# Altium project Dashcam.PrjPcb (part 7 of 8)

## Sheet CAMERA.SchDoc
size A2; SheetNumber: 20; SheetTotal: 22
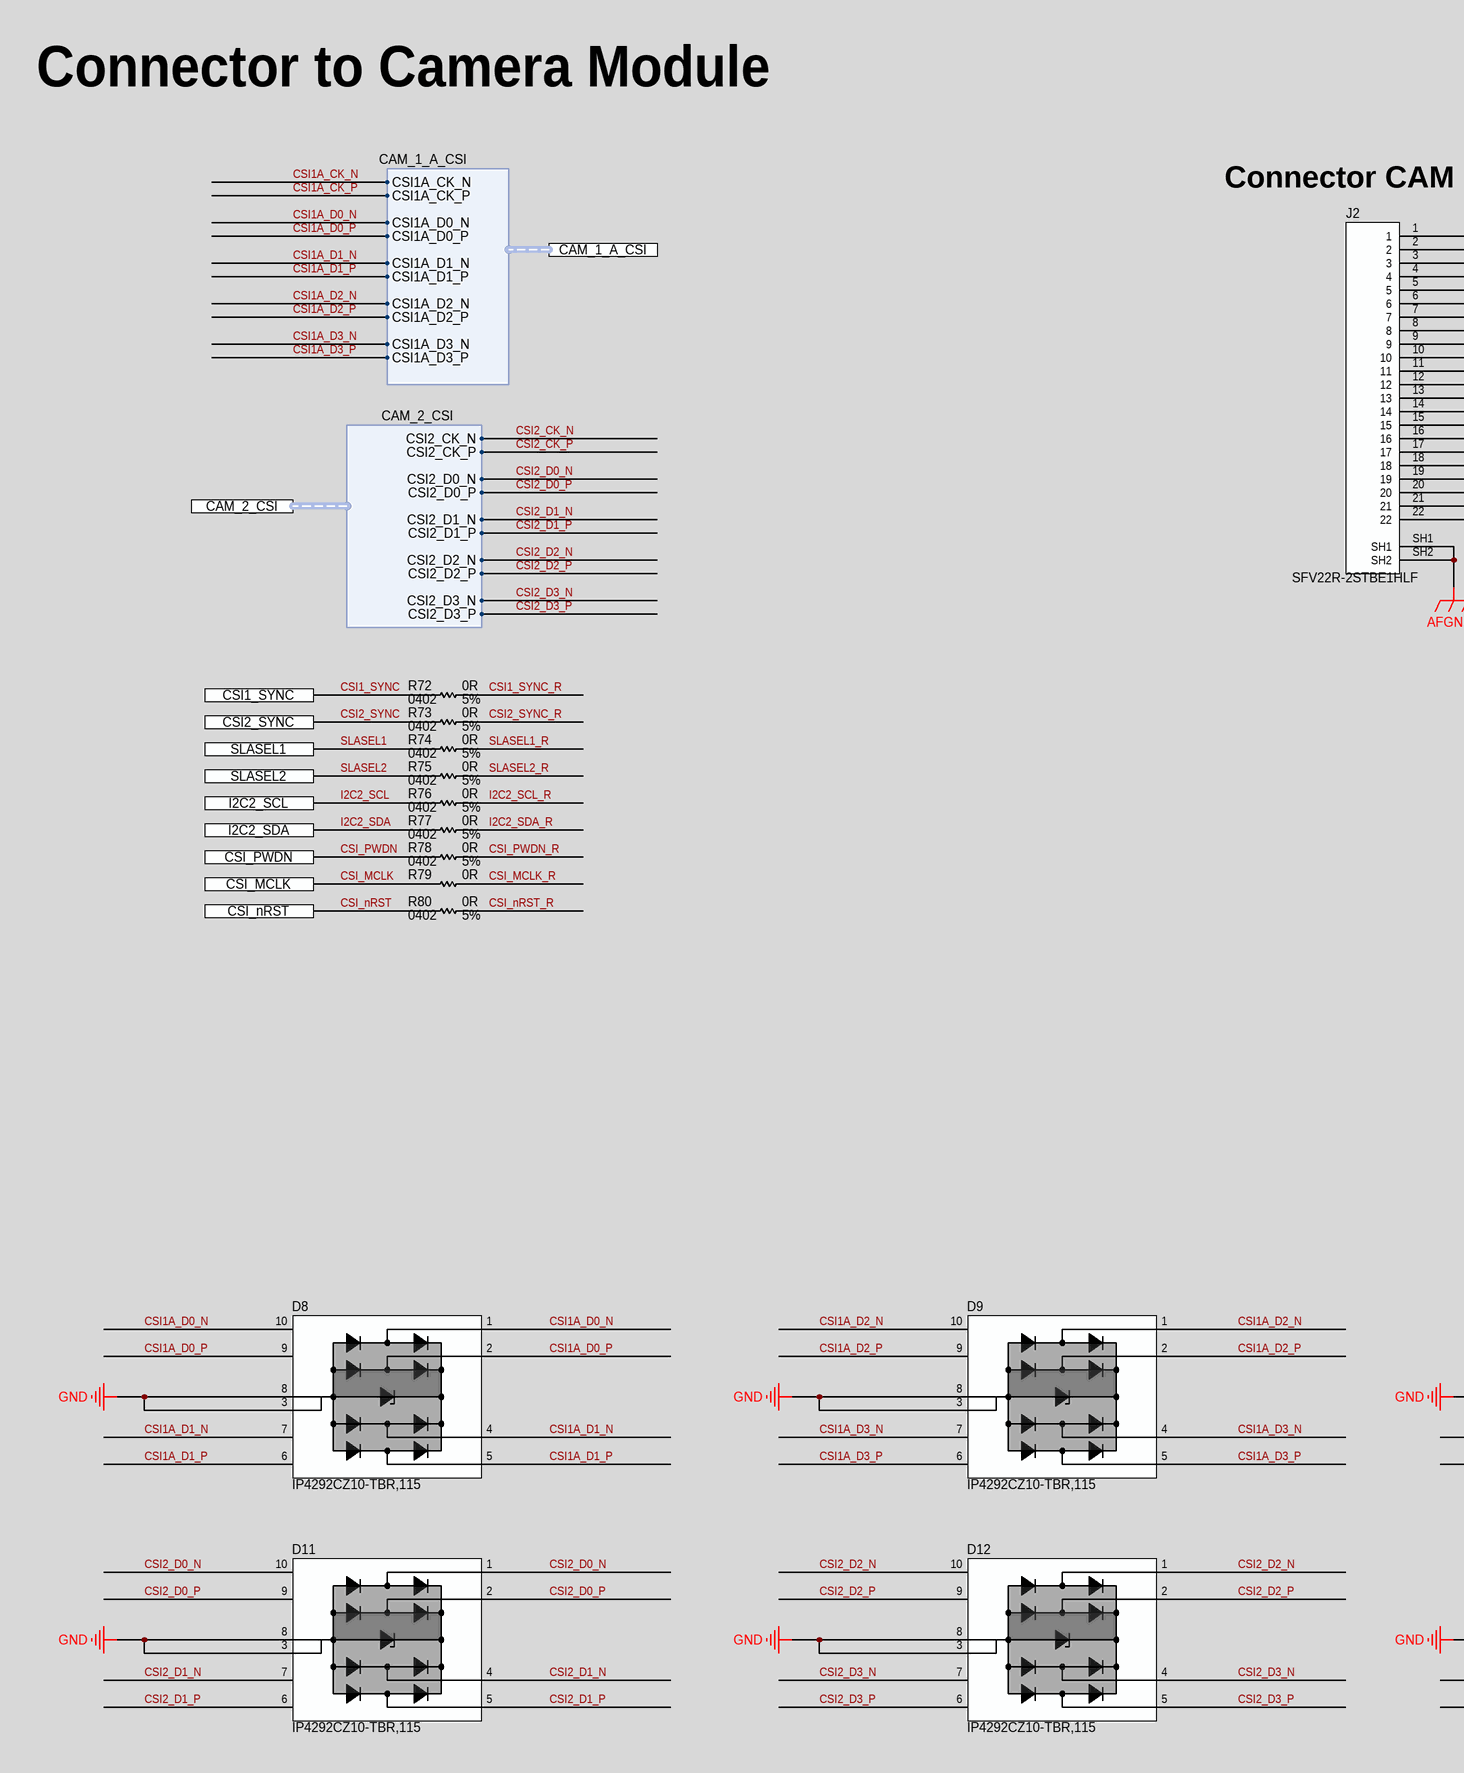
[diagram p17: CAMERA.SchDoc, left]
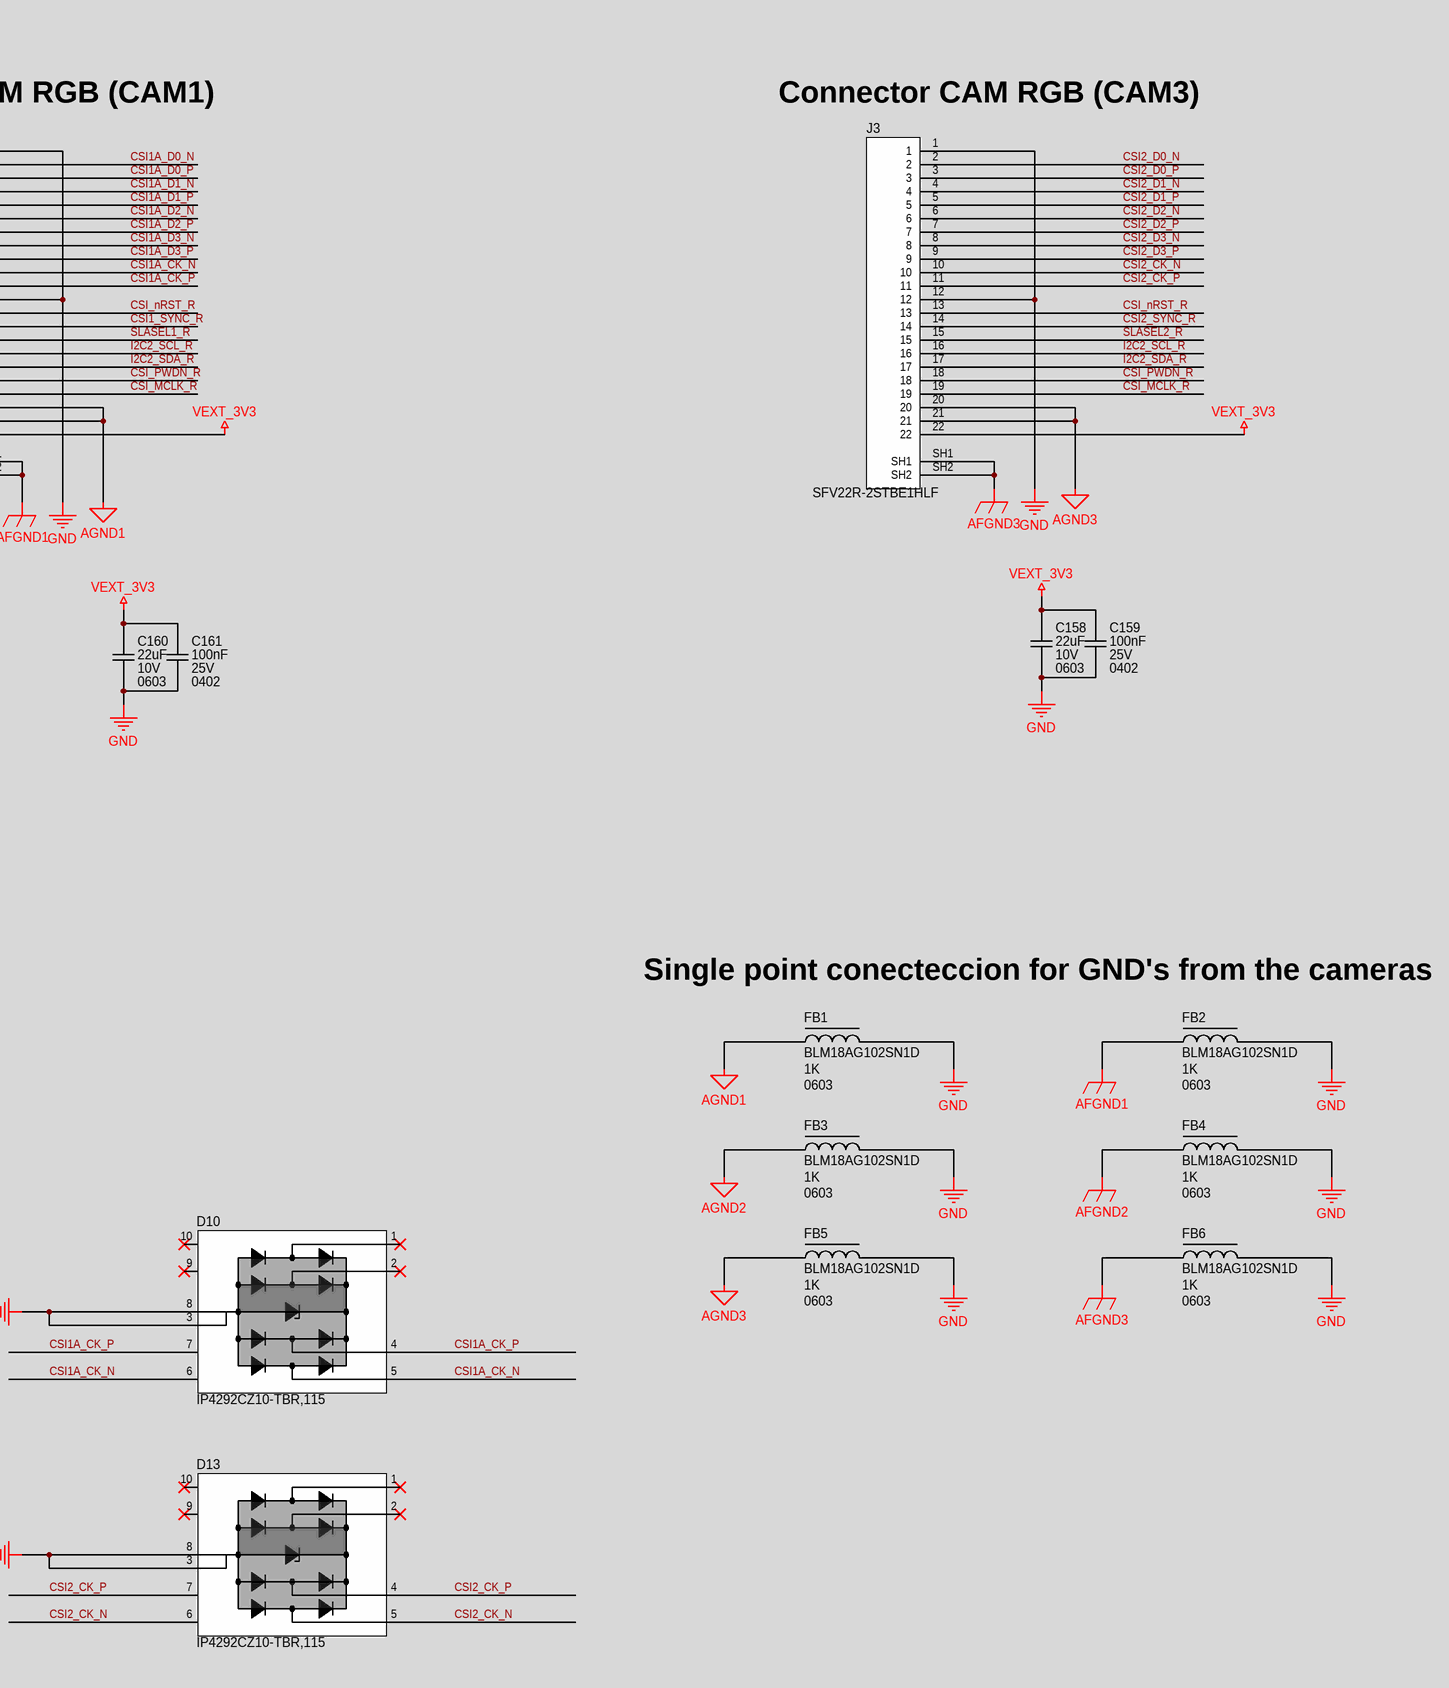
[diagram p18: CAMERA.SchDoc, right]

### Parts
C158  Capacitance: 22uF  Voltage Rating: 10V  Case Code (Imperial): 0603  [CAP_0603_CAPC1608X08N]  (hidden comment: C1608X5R1A226M080AC)
C159  Capacitance: 100nF  Voltage Rating: 25V  Case/Package: 0402  [CAP_0402_CAPC1005X05N]  (hidden comment: CC0402KRX5R8BB104)
C160  Capacitance: 22uF  Voltage Rating: 10V  Case Code (Imperial): 0603  [CAP_0603_CAPC1608X08N]  (hidden comment: C1608X5R1A226M080AC)
C161  Capacitance: 100nF  Voltage Rating: 25V  Case/Package: 0402  [CAP_0402_CAPC1005X05N]  (hidden comment: CC0402KRX5R8BB104)
D8  IP4292CZ10-TBR,115  [DIO_TVS_SON50P100X250X50-10N]
D9  IP4292CZ10-TBR,115  [DIO_TVS_SON50P100X250X50-10N]
D10  IP4292CZ10-TBR,115  [DIO_TVS_SON50P100X250X50-10N]
D11  IP4292CZ10-TBR,115  [DIO_TVS_SON50P100X250X50-10N]
D12  IP4292CZ10-TBR,115  [DIO_TVS_SON50P100X250X50-10N]
D13  IP4292CZ10-TBR,115  [DIO_TVS_SON50P100X250X50-10N]
FB1  BLM18AG102SN1D  Impedance: 1K  Case/Package: 0603  [IND_0603_INDC1608X08N]
FB2  BLM18AG102SN1D  Impedance: 1K  Case/Package: 0603  [IND_0603_INDC1608X08N]
FB3  BLM18AG102SN1D  Impedance: 1K  Case/Package: 0603  [IND_0603_INDC1608X08N]
FB4  BLM18AG102SN1D  Impedance: 1K  Case/Package: 0603  [IND_0603_INDC1608X08N]
FB5  BLM18AG102SN1D  Impedance: 1K  Case/Package: 0603  [IND_0603_INDC1608X08N]
FB6  BLM18AG102SN1D  Impedance: 1K  Case/Package: 0603  [IND_0603_INDC1608X08N]
J2  SFV22R-2STBE1HLF  [CONN_FPC_AMPHENOL_SFV22R-2STBE1HLF]
J3  SFV22R-2STBE1HLF  [CONN_FPC_AMPHENOL_SFV22R-2STBE1HLF]
R72  Case Code (Imperial): 0402  Tolerance: 5%  Resistance: 0R  [RES_0402_RESC1005X04N]  (hidden comment: ERJ-2GE0R00X)
R73  Case Code (Imperial): 0402  Tolerance: 5%  Resistance: 0R  [RES_0402_RESC1005X04N]  (hidden comment: ERJ-2GE0R00X)
R74  Case Code (Imperial): 0402  Tolerance: 5%  Resistance: 0R  [RES_0402_RESC1005X04N]  (hidden comment: ERJ-2GE0R00X)
R75  Case Code (Imperial): 0402  Tolerance: 5%  Resistance: 0R  [RES_0402_RESC1005X04N]  (hidden comment: ERJ-2GE0R00X)
R76  Case Code (Imperial): 0402  Tolerance: 5%  Resistance: 0R  [RES_0402_RESC1005X04N]  (hidden comment: ERJ-2GE0R00X)
R77  Case Code (Imperial): 0402  Tolerance: 5%  Resistance: 0R  [RES_0402_RESC1005X04N]  (hidden comment: ERJ-2GE0R00X)
R78  Case Code (Imperial): 0402  Tolerance: 5%  Resistance: 0R  [RES_0402_RESC1005X04N]  (hidden comment: ERJ-2GE0R00X)
R79  Resistance: 0R  [RES_0402_RESC1005X04N]  (hidden comment: ERJ-2GE0R00X)
R80  Case Code (Imperial): 0402  Tolerance: 5%  Resistance: 0R  [RES_0402_RESC1005X04N]  (hidden comment: ERJ-2GE0R00X)

### Ports
CAM_1_A_CSI (harness CAM_1_A_CSI), CAM_2_CSI (harness CAM_2_CSI), CSI1_SYNC, CSI2_SYNC, CSI_MCLK, CSI_nRST, CSI_PWDN, I2C2_SCL, I2C2_SDA, SLASEL1, SLASEL2

### Harnesses
CAM_2_CSI: CSI2_CK_N, CSI2_CK_P, CSI2_D0_N, CSI2_D0_P, CSI2_D1_N, CSI2_D1_P, CSI2_D2_N, CSI2_D2_P, CSI2_D3_N, CSI2_D3_P
CAM_1_A_CSI: CSI1A_CK_N, CSI1A_CK_P, CSI1A_D0_N, CSI1A_D0_P, CSI1A_D1_N, CSI1A_D1_P, CSI1A_D2_N, CSI1A_D2_P, CSI1A_D3_N, CSI1A_D3_P

### Nets
AFGND1: FB2.1 J2.SH1 J2.SH2
AFGND2: FB4.1
AFGND3: FB6.1 J3.SH1 J3.SH2
AGND1: FB1.1 J2.20 J2.21
AGND2: FB3.1
AGND3: FB5.1 J3.20 J3.21
GND: C158.1 C159.1 C160.1 C161.1 D8.3(GND1) D8.8(GND2) D9.3(GND1) D9.8(GND2) D10.3(GND1) D10.8(GND2) D11.3(GND1) D11.8(GND2) D12.3(GND1) D12.8(GND2) D13.3(GND1) D13.8(GND2) FB1.2 FB2.2 FB3.2 FB4.2 FB5.2 FB6.2 J2.1 J2.12 J3.1 J3.12
VEXT_3V3: C158.2 C159.2 C160.2 C161.2 J2.22 J3.22
CSI1_SYNC: R72.1 ; port CSI1_SYNC
CSI1_SYNC_R: J2.14 R72.2
CSI1A_CK_N: D10.5(CH4) D10.6(NC1) J2.10 ; port CAM_1_A_CSI.CSI1A_CK_N
CSI1A_CK_P: D10.4(CH3) D10.7(NC2) J2.11 ; port CAM_1_A_CSI.CSI1A_CK_P
CSI1A_D0_N: D8.1(CH1) D8.10(NC4) J2.2 ; port CAM_1_A_CSI.CSI1A_D0_N
CSI1A_D0_P: D8.2(CH2) D8.9(NC3) J2.3 ; port CAM_1_A_CSI.CSI1A_D0_P
CSI1A_D1_N: D8.4(CH3) D8.7(NC2) J2.4 ; port CAM_1_A_CSI.CSI1A_D1_N
CSI1A_D1_P: D8.5(CH4) D8.6(NC1) J2.5 ; port CAM_1_A_CSI.CSI1A_D1_P
CSI1A_D2_N: D9.1(CH1) D9.10(NC4) J2.6 ; port CAM_1_A_CSI.CSI1A_D2_N
CSI1A_D2_P: D9.2(CH2) D9.9(NC3) J2.7 ; port CAM_1_A_CSI.CSI1A_D2_P
CSI1A_D3_N: D9.4(CH3) D9.7(NC2) J2.8 ; port CAM_1_A_CSI.CSI1A_D3_N
CSI1A_D3_P: D9.5(CH4) D9.6(NC1) J2.9 ; port CAM_1_A_CSI.CSI1A_D3_P
CSI2_CK_N: D13.5(CH4) D13.6(NC1) J3.10 ; port CAM_2_CSI.CSI2_CK_N
CSI2_CK_P: D13.4(CH3) D13.7(NC2) J3.11 ; port CAM_2_CSI.CSI2_CK_P
CSI2_D0_N: D11.1(CH1) D11.10(NC4) J3.2 ; port CAM_2_CSI.CSI2_D0_N
CSI2_D0_P: D11.2(CH2) D11.9(NC3) J3.3 ; port CAM_2_CSI.CSI2_D0_P
CSI2_D1_N: D11.4(CH3) D11.7(NC2) J3.4 ; port CAM_2_CSI.CSI2_D1_N
CSI2_D1_P: D11.5(CH4) D11.6(NC1) J3.5 ; port CAM_2_CSI.CSI2_D1_P
CSI2_D2_N: D12.1(CH1) D12.10(NC4) J3.6 ; port CAM_2_CSI.CSI2_D2_N
CSI2_D2_P: D12.2(CH2) D12.9(NC3) J3.7 ; port CAM_2_CSI.CSI2_D2_P
CSI2_D3_N: D12.4(CH3) D12.7(NC2) J3.8 ; port CAM_2_CSI.CSI2_D3_N
CSI2_D3_P: D12.5(CH4) D12.6(NC1) J3.9 ; port CAM_2_CSI.CSI2_D3_P
CSI2_SYNC: R73.1 ; port CSI2_SYNC
CSI2_SYNC_R: J3.14 R73.2
CSI_MCLK: R79.1 ; port CSI_MCLK
CSI_MCLK_R: J2.19 J3.19 R79.2
CSI_nRST: R80.1 ; port CSI_nRST
CSI_nRST_R: J2.13 J3.13 R80.2
CSI_PWDN: R78.1 ; port CSI_PWDN
CSI_PWDN_R: J2.18 J3.18 R78.2
I2C2_SCL: R76.1 ; port I2C2_SCL
I2C2_SCL_R: J2.16 J3.16 R76.2
I2C2_SDA: R77.1 ; port I2C2_SDA
I2C2_SDA_R: J2.17 J3.17 R77.2
SLASEL1: R74.1 ; port SLASEL1
SLASEL1_R: J2.15 R74.2
SLASEL2: R75.1 ; port SLASEL2
SLASEL2_R: J3.15 R75.2

Not connected (* = marked no-connect by the designer): D10 1(CH1)* 2(CH2)* 9(NC3)* 10(NC4)*; D13 1(CH1)* 2(CH2)* 9(NC3)* 10(NC4)*

### Notes on the sheet
- Connector to Camera Module
- (near J2) Connector CAM RGB (CAM1)
- (near J3) Connector CAM RGB (CAM3)
- Single point conecteccion for GND's from the cameras
- PCB Des :
- Approv By :
- Project Title :
- Sheet Title :
- Date :
- Page :
- PCB Version :
- PCB Revision :
- Size :
- A2

### Library data of the parts
C158 C160 = CAP_22UF_10V_X5R_0603: Multilayer Ceramic Capacitor, 22 uF, 10 V, ± 20%, X5R, 0603 [1608 Metric]; Manufacturer: TDK; Supplier 1: Digi-Key; Manufacturer Part Number: C1608X5R1A226M080AC; RoHS: Yes; Category: Ceramic Capacitors; Stock 1: 1971709; Pricing 1: 1=0.32, 10=0.208, 50=0.1534, 100=0.1248, 500=0.09856, 1000=0.08323 (USD); Mount: Surface Mount; Case/Package: 0603; Case Code (Metric): 1608; Dielectric Material: Ceramic; Weight: 7.1E-05oz; Min Operating Temperature: -55°C; Max Operating Temperature: 85°C; Tolerance: 20%; Packaging: Tape and Reel; Voltage Rating (DC): 10V; Termination: SMD/SMT; Series: C; Package Quantity: 4000; Dielectric: X5R; Length: 1.6mm; Width: 0.8mm; Height: 0.8mm; Reach SVHC Compliant: No; Lead Free: Lead Free; RoHS Compliant: Yes; ComponentLink1URL: https://datasheet.ciiva.com/6274/tdkmlcccaprange-6274860.pdf?src-supplier=Digi-Key; ComponentLink1Description: https://datasheet.ciiva.com/6274/tdkmlcccaprange-6274860.pdf?src-supplier=Digi-Key; ComponentLink2URL: https://datasheet.ciiva.com/6274/tdkmlcccaprange-6274859.pdf?src-supplier=Digi-Key; ComponentLink2Description: https://datasheet.ciiva.com/6274/tdkmlcccaprange-6274859.pdf?src-supplier=Digi-Key; ComponentLink3URL: https://datasheet.ciiva.com/6274/tdkmlcccaprange-6274861.pdf?src-supplier=Digi-Key; ComponentLink3Description: https://datasheet.ciiva.com/6274/tdkmlcccaprange-6274861.pdf?src-supplier=Digi-Key; ComponentLink4URL: https://datasheet.ciiva.com/24216/mlcc-commercial-general-en-24216575.pdf?src-supplier=Mouser; ComponentLink4Description: https://datasheet.ciiva.com/24216/mlcc-commercial-general-en-24216575.pdf?src-supplier=Mouser; Supplier Part Number 1: 445-9077-1-ND
C159 C161 = CAP_100NF_25V_X7R_0402: Multilayer Ceramic Capacitor, 0.1 uF, 25 V, ± 10%, X7R, 0402 [1005 Metric]; Manufacturer: Yageo; Material: 4241ConductorMaterial; Dielectric: X5R; Temperature Coefficient: 30ppm/°C; Supplier 1: Digikey; Manufacturer Part Number: CC0402KRX5R8BB104; RoHS: Yes; Category: Ceramic Capacitors; Stock 1: 3706055; Pricing 1: 1=0.1, 10=0.037, 50=0.021, 100=0.0162, 500=0.01224, 1000=0.00961, 2500=0.00874, 5000=0.00804 (USD); Mount: Surface Mount; Case Code (Metric): 1005; Case Code (Imperial): 0402; Min Operating Temperature: -55°C; Max Operating Temperature: 85°C; Tolerance: 10%; Packaging: Tape and Reel; Voltage Rating (DC): 25V; Series: CC; RoHS Compliant: Yes; Lead Free: 5697LeadFree; Halogen Free: 5694HalogenFree; ComponentLink1URL: http://www.mouser.com/ds/2/447/UPY-GPHC_X5R_4V-to-50V_25-1131599.pdf?src-supplier=Mouser; ComponentLink1Description: http://www.mouser.com/ds/2/447/UPY-GPHC_X5R_4V-to-50V_25-1131599.pdf?src-supplier=Mouser; ComponentLink2URL: https://datasheet.octopart.com/CC0402KRX5R8BB104-Yageo-datasheet-137700082.pdf?src-supplier=Future+Electronics; ComponentLink2Description: https://datasheet.octopart.com/CC0402KRX5R8BB104-Yageo-datasheet-137700082.pdf?src-supplier=Future+Electronics; ComponentLink3URL: http://www.yageo.com/documents/recent/UPY-GPHC_X5R_4V-to-50V_25.pdf?src-supplier=Digikey; ComponentLink3Description: http://www.yageo.com/documents/recent/UPY-GPHC_X5R_4V-to-50V_25.pdf?src-supplier=Digikey; ComponentLink4URL: https://datasheet.octopart.com/CC0402KRX5R8BB104-Yageo-datasheet-140260304.pdf?src-supplier=Newark; ComponentLink4Description: https://datasheet.octopart.com/CC0402KRX5R8BB104-Yageo-datasheet-140260304.pdf?src-supplier=Newark; ComponentLink5URL: https://datasheet.octopart.com/CC0402KRX5R8BB104-Yageo-datasheet-170350636.pdf?src-supplier=Future+Electronics; ComponentLink5Description: https://datasheet.octopart.com/CC0402KRX5R8BB104-Yageo-datasheet-170350636.pdf?src-supplier=Future+Electronics; ComponentLink6URL: http://www.yageo.com/documents/recent/UPY-GPHC_X5R_4V-to-50V-16.pdf?src-supplier=Future+Electronics; ComponentLink6Description: http://www.yageo.com/documents/recent/UPY-GPHC_X5R_4V-to-50V-16.pdf?src-supplier=Future+Electronics; Supplier Part Number 1: 311-1697-6-ND
D8-D13 = DIO_TVS_4CH_4V_IP4292CZ10-TBR,115: IP4292CZ10 Series 4 Channel 4 V 0.55 pF ESD Protected TVS Diode - DFN2510A-10; Manufacturer: Nexperia; Supplier 1: Digikey; Manufacturer Part Number: IP4292CZ10-TBR,115; RoHS: Yes; Category: ESD and Circuit Protection ICs; Stock 1: 24808; Pricing 1: 1=0.51, 10=0.398, 100=0.2386, 500=0.22096, 1000=0.15025, 2000=0.13833 (USD); RoHS Compliant: Yes; ComponentLink1URL: https://assets.nexperia.com/documents/data-sheet/IP4292CZ10-TBR.pdf?src-supplier=Digikey; ComponentLink1Description: https://assets.nexperia.com/documents/data-sheet/IP4292CZ10-TBR.pdf?src-supplier=Digikey; Supplier Part Number 1: 1727-1219-1-ND
FB1-FB6 = IND_FERRITA_1K_450mA_BLM18AG102SN1D: Ferrite Beads Multi-Layer 1KOhm 25% 100MHz 450mA 500mOhm DCR 0603 T/R; Manufacturer: Murata; Material: Steel,Ferrite; Max DC Current: 400mA; DC Resistance (DCR): 500mR; Number of Lines: 1; Shielding: Unshielded; DC Resistance-Max: 700mR; Supplier 1: Digikey; Manufacturer Part Number: BLM18AG102SN1D; RoHS: Yes; Category: Ferrite Beads and Chips; Stock 1: 632067; Pricing 1: 1=0.1, 10=0.074, 25=0.0676, 50=0.0608, 100=0.0445, 250=0.0324, 500=0.02968, 1000=0.02564 (USD); Number of Pins: 2; Core Material: Ferrite; Case Code (Metric): 1608; Case Code (Imperial): 0603; Min Operating Temperature: -55°C; Max Operating Temperature: 125°C; Tolerance: 25%; Package Quantity: 1; Resistance: 500mR; Packaging: Tape and Reel; Current Rating: 400mA; Max Current Rating: 400mA; Termination: SMD/SMT; Test Frequency: 100MHz; DC Current: 400mA; Frequency: 100MHz; Number of Circuits: 1; Series: BLM18A; RMS Current (Irms): 450mA; Series Resistance: 500mR; Length: 1.6mm; Width: 0.8mm; Height: 0.8mm; Depth: 0.8mm; Radiation Hardening: No; Reach SVHC Compliant: No; Military Standard: Not; Lead Free: Lead Free; RoHS Compliant: Yes; ComponentLink1URL: https://datasheet.ciiva.com/1012/l0110s0100blm18a-1012016.pdf?src-supplier=Digikey; ComponentLink1Description: https://datasheet.ciiva.com/1012/l0110s0100blm18a-1012016.pdf?src-supplier=Digikey; ComponentLink2URL: https://datasheet.ciiva.com/5709/1756147-5709056.pdf?src-supplier=Farnell; ComponentLink2Description: https://datasheet.ciiva.com/5709/1756147-5709056.pdf?src-supplier=Farnell; ComponentLink3URL: https://datasheet.ciiva.com/11795/0900766b80032ea2-11795437.pdf?src-supplier=Rs; ComponentLink3Description: https://datasheet.ciiva.com/11795/0900766b80032ea2-11795437.pdf?src-supplier=Rs; ComponentLink4URL: https://datasheet.ciiva.com/29347/442253-da-01-en-chip-drossel-0603-1000r-400ma-1-6x0-8mm-29347887.pdf?src-supplier=Conrad; ComponentLink4Description: https://datasheet.ciiva.com/29347/442253-da-01-en-chip-drossel-0603-1000r-400ma-1-6x0-8mm-29347887.pdf?src-supplier=Conrad; ComponentLink5URL: https://datasheet.ciiva.com/41449/001172220-da-01-en-drossel-0603-1000r-1-6x0-8mm-4000st-41449508.pdf?src-supplier=Conrad; ComponentLink5Description: https://datasheet.ciiva.com/41449/001172220-da-01-en-drossel-0603-1000r-1-6x0-8mm-4000st-41449508.pdf?src-supplier=Conrad; ComponentLink6URL: https://datasheet.ciiva.com/1012/l0110s0100blm18a-1012014.pdf?src-supplier=Digikey; ComponentLink6Description: https://datasheet.ciiva.com/1012/l0110s0100blm18a-1012014.pdf?src-supplier=Digikey; ComponentLink7URL: https://datasheet.ciiva.com/1012/l0110s0100blm18a-1012015.pdf?src-supplier=Digikey; ComponentLink7Description: https://datasheet.ciiva.com/1012/l0110s0100blm18a-1012015.pdf?src-supplier=Digikey; ComponentLink8URL: https://datasheet.ciiva.com/16199/l0110s0100blm18a-16199225.pdf?src-supplier=Future+Electronics; ComponentLink8Description: https://datasheet.ciiva.com/16199/l0110s0100blm18a-16199225.pdf?src-supplier=Future+Electronics; ComponentLink9URL: https://datasheet.ciiva.com/8510/l0110s0100blm18a-8510154.pdf?src-supplier=Avnet; ComponentLink9Description: https://datasheet.ciiva.com/8510/l0110s0100blm18a-8510154.pdf?src-supplier=Avnet; ComponentLink10URL: https://datasheet.ciiva.com/1466/1756147-1466919.pdf?src-supplier=Element14; ComponentLink10Description: https://datasheet.ciiva.com/1466/1756147-1466919.pdf?src-supplier=Element14; ComponentLink11URL: https://datasheet.ciiva.com/1466/1756147-1466920.pdf?src-supplier=Element14; ComponentLink11Description: https://datasheet.ciiva.com/1466/1756147-1466920.pdf?src-supplier=Element14; Supplier Part Number 1: 490-1015-1-ND
J2 J3 = CONN_FPC_22P_0.5mm_SFV22R-2STBE1HLF: Conn FFC/FPC Connector SKT 22 POS 0.5mm Solder RA SMD Embossed T/R; Manufacturer: Amphenol ICC / FCI; Actuator Material: Glass,Polyphenylene; Voltage Rating: 50V; Current Rating: 500mA; Number of Positions: 22; Contact Location: Top; Insulation Resistance: 100MR; Wire/Cable Type: Straight; Supplier 1: Digikey; Manufacturer Part Number: SFV22R-2STBE1HLF; RoHS: Yes; Category: FFC / FPC; Stock 1: 4153; Pricing 1: 1=0.74, 10=0.627, 25=0.6016, 50=0.5888, 100=0.5633, 250=0.51208, 500=0.46086, 1000=0.40966 (USD); Mount: Surface Mount; Contact Material: Bronze; Contact Plating: Gold; Housing Material: Polymer; Min Operating Temperature: -55°C; Max Operating Temperature: 105°C; Termination: Solder; Number of Contacts: 22; Orientation: Right Angle; Packaging: Tape and Reel; Package Quantity: 3000; Series: SFV-R; Pitch: 0.5mm; Radiation Hardening: No; Flammability Rating: UL94 V-0; RoHS Compliant: Yes; ComponentLink1URL: https://datasheet.ciiva.com/18563/sfv12b-hlf-18563830.pdf?src-supplier=Digikey; ComponentLink1Description: https://datasheet.ciiva.com/18563/sfv12b-hlf-18563830.pdf?src-supplier=Digikey; Supplier Part Number 1: 609-SFV22R-2STBE1HLFCT-ND
R72-R80 = RES_0R_5%_100mW_0402: SMD Chip Resistor, Jumper, 0 ohm, 100 mW, 0402 [1005 Metric], Thick Film, General Purpose; Manufacturer: Panasonic; Power Rating: 100mW; Voltage Rating: 50V; Temperature Coefficient: 600ppm/°C; Supplier 1: Mouser; Manufacturer Part Number: ERJ-2GE0R00X; RoHS: Yes; Category: Chip SMD Resistors; Stock 1: 10989354; Pricing 1: 1=0.1, 10=0.013, 50=0.013, 100=0.006, 1000=0.004, 2500=0.003, 10000=0.003 (USD); Mount: Surface Mount; Case/Package: 0402; Contact Plating: Tin; Case Code (Metric): 1005; Size Code: 0402; Min Operating Temperature: -55°C; Max Operating Temperature: 155°C; Resistor Type: Thick Film; Packaging: Cut Tape; Package Quantity: 10000; Number of Terminations: 2; Termination: SMD/SMT; Max Power Dissipation: 100mW; Voltage Rating (DC): 50V; Features: Automotive AEC-Q200; Series: ERJ; Construction: Rectangular; Technology: THICK FILM; Length: 1mm; Width: 0.5mm; Height: 0.35mm; Depth: 0.5mm; Ratings: AEC-Q200; Radiation Hardening: No; Reach SVHC Compliant: No; Military Standard: Not; Lead Free: Lead Free; RoHS Compliant: Yes; ComponentLink1URL: https://datasheet.ciiva.com/11821/0900766b80f806dd-11821176.pdf?src-supplier=Rs; ComponentLink1Description: https://datasheet.ciiva.com/11821/0900766b80f806dd-11821176.pdf?src-supplier=Rs; ComponentLink2URL: https://datasheet.ciiva.com/43460/1678796-43460347.pdf?src-supplier=Farnell; ComponentLink2Description: https://datasheet.ciiva.com/43460/1678796-43460347.pdf?src-supplier=Farnell; ComponentLink3URL: https://datasheet.ciiva.com/46389/1678796-46389518.pdf?src-supplier=Element14; ComponentLink3Description: https://datasheet.ciiva.com/46389/1678796-46389518.pdf?src-supplier=Element14; ComponentLink4URL: https://datasheet.ciiva.com/5959/1678796-5959692.pdf?src-supplier=Farnell; ComponentLink4Description: https://datasheet.ciiva.com/5959/1678796-5959692.pdf?src-supplier=Farnell; ComponentLink5URL: https://datasheet.ciiva.com/28695/1678796-28695758.pdf?src-supplier=Element14; ComponentLink5Description: https://datasheet.ciiva.com/28695/1678796-28695758.pdf?src-supplier=Element14; ComponentLink6URL: https://datasheet.ciiva.com/16783/70260739-16783734.pdf?src-supplier=Allied+Electronics; ComponentLink6Description: https://datasheet.ciiva.com/16783/70260739-16783734.pdf?src-supplier=Allied+Electronics; ComponentLink7URL: https://datasheet.ciiva.com/16778/70260739-16778335.pdf?src-supplier=Allied+Electronics; ComponentLink7Description: https://datasheet.ciiva.com/16778/70260739-16778335.pdf?src-supplier=Allied+Electronics; ComponentLink8URL: https://datasheet.ciiva.com/48531/aoa0000ce1-48531077.pdf?src-supplier=Avnet; ComponentLink8Description: https://datasheet.ciiva.com/48531/aoa0000ce1-48531077.pdf?src-supplier=Avnet; ComponentLink9URL: https://datasheet.ciiva.com/30097/4aoa0000ce1-30097116.pdf?src-supplier=Onlinecomponents.com; ComponentLink9Description: https://datasheet.ciiva.com/30097/4aoa0000ce1-30097116.pdf?src-supplier=Onlinecomponents.com; Supplier Part Number 1: 667-ERJ-2GE0R00X

## Sheet WIFI_BLE.SchDoc
size A2; SheetNumber: 21; SheetTotal: 22
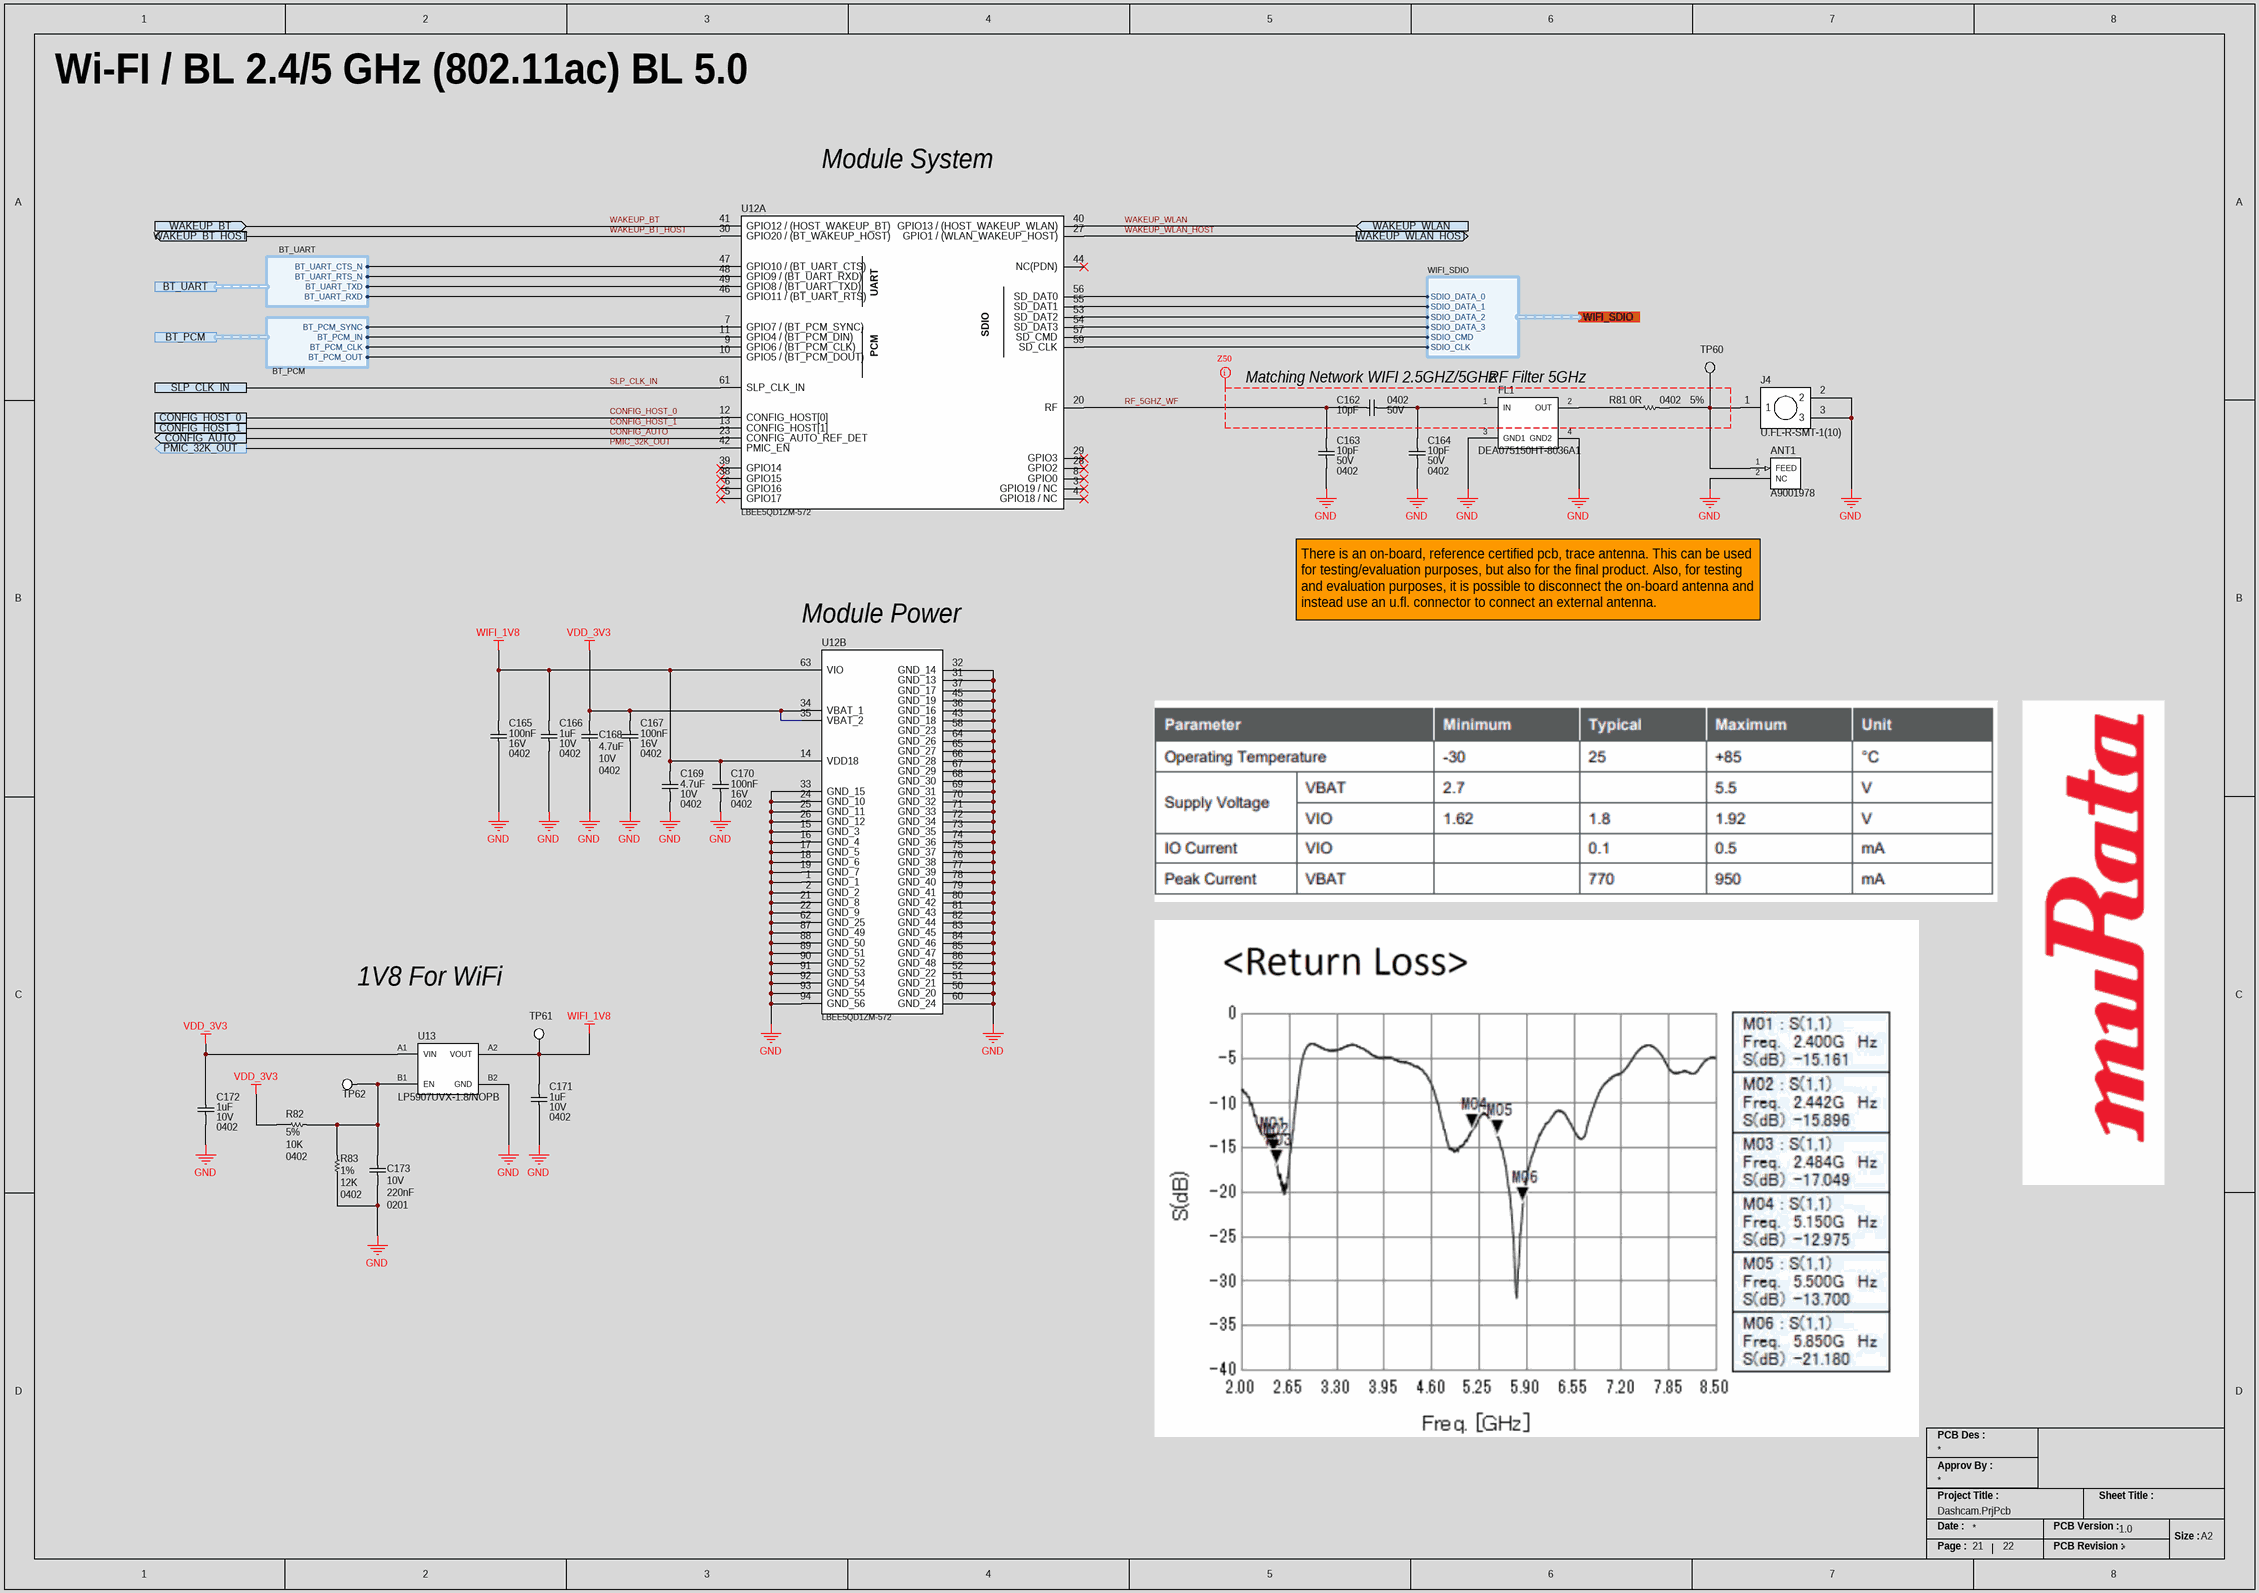
[diagram p19: WIFI_BLE.SchDoc]

### Parts
ANT1  A9001978  [ANTENNA_CHIP_ANTC1006X50N]
C162  Case/Package: 0402  Voltage Rating: 50V  Capacitance: 10pF  [CAP_0402_CAPC1005X05N]  (hidden comment: GJM1555C1H100FB01D)
C163  Case/Package: 0402  Voltage Rating: 50V  Capacitance: 10pF  [CAP_0402_CAPC1005X05N]  (hidden comment: GJM1555C1H100FB01D)
C164  Case/Package: 0402  Voltage Rating: 50V  Capacitance: 10pF  [CAP_0402_CAPC1005X05N]  (hidden comment: GJM1555C1H100FB01D)
C165  Voltage Rating: 16V  Capacitance: 100nF  Case/Package: 0402  [CAP_0402_CAPC1005X05N]  (hidden comment: CL05B104KO5NNNC)
C166  Voltage Rating: 10V  Capacitance: 1uF  Case/Package: 0402  [CAP_0402_CAPC1005X05N]  (hidden comment: GRM155C81A105KA12D)
C167  Voltage Rating: 16V  Capacitance: 100nF  Case/Package: 0402  [CAP_0402_CAPC1005X05N]  (hidden comment: CL05B104KO5NNNC)
C168  Capacitance: 4.7uF  Voltage Rating: 10V  Case/Package: 0402  [CAP_0402_CAPC1005X05N]  (hidden comment: CL05A475KP5NRNC)
C169  Capacitance: 4.7uF  Voltage Rating: 10V  Case/Package: 0402  [CAP_0402_CAPC1005X05N]  (hidden comment: CL05A475KP5NRNC)
C170  Voltage Rating: 16V  Capacitance: 100nF  Case/Package: 0402  [CAP_0402_CAPC1005X05N]  (hidden comment: CL05B104KO5NNNC)
C171  Voltage Rating: 10V  Capacitance: 1uF  Case/Package: 0402  [CAP_0402_CAPC1005X05N]  (hidden comment: GRM155C81A105KA12D)
C172  Voltage Rating: 10V  Capacitance: 1uF  Case/Package: 0402  [CAP_0402_CAPC1005X05N]  (hidden comment: GRM155C81A105KA12D)
C173  Voltage Rating (DC): 10V  Capacitance: 220nF  Case/Package: 0201  [CAP_0201_CAPC0603X03N]  (hidden comment: LMK063BJ224MP-F)
FL1  DEA075150HT-8036A1  [RF_FILTER_HP_DEA075150HT8036A1]
J4  U.FL-R-SMT-1(10)  [CONN_UFL_U.FL-R-SMT-1(10)]
R81  Case Code (Imperial): 0402  Tolerance: 5%  Resistance: 0R  [RES_0402_RESC1005X04N]  (hidden comment: ERJ-2GE0R00X)
R82  Tolerance: 5%  Resistance: 10K  Case/Package: 0402  [RES_0402_RESC1005X04N]  (hidden comment: ERJ-2GEJ103X)
R83  Tolerance: 1%  Resistance: 12K  Case/Package: 0402  [RES_0402_RESC1005X04N]  (hidden comment: ERJ-2RKF1202X)
TP60  NO COMPONENT  [TP_PAD_0.5MM_SMD_ROUND]  (value not drawn)  (no BOM)
TP61  NO COMPONENT  [TP_PAD_0.8MM_SMD_ROUND]  (value not drawn)  (no BOM)
TP62  NO COMPONENT  [TP_PAD_0.8MM_SMD_ROUND]  (value not drawn)  (no BOM)
U12  LBEE5QD1ZM-572  [IC_WIFI_BLE_LBEE5QD1ZM572]  (parts A,B of 2)
U13  LP5907UVX-1.8/NOPB  [IC_REG_LDO_BGA4C35P2X2_71X71X40]

### Ports
BT_PCM (harness BT_PCM), BT_UART (harness BT_UART), CONFIG_AUTO (out), CONFIG_HOST_0, CONFIG_HOST_1, PMIC_32K_OUT (out), SLP_CLK_IN, WAKEUP_BT (in), WAKEUP_BT_HOST (out), WAKEUP_WLAN (in), WAKEUP_WLAN_HOST (out), WIFI_SDIO (harness WIFI_SDIO)

### Harnesses
WIFI_SDIO: SDIO_CLK, SDIO_CMD, SDIO_DATA_0, SDIO_DATA_1, SDIO_DATA_2, SDIO_DATA_3
BT_UART: BT_UART_CTS_N, BT_UART_RTS_N, BT_UART_TXD, BT_UART_RXD
BT_PCM: BT_PCM_SYNC, BT_PCM_IN, BT_PCM_CLK, BT_PCM_OUT

### Nets
GND: ANT1.2(NC) C163.1 C164.1 C165.1 C166.1 C167.1 C168.1 C169.1 C170.1 C171.1 C172.1 C173.1 FL1.3(GND1) FL1.4(GND2) J4.2 J4.3 R83.1 U12.1(GND_1) U12.2(GND_2) U12.15(GND_3) U12.16(GND_4) U12.17(GND_5) U12.18(GND_6) U12.19(GND_7) U12.21(GND_8) U12.22(GND_9) U12.24(GND_10) U12.25(GND_11) U12.26(GND_12) U12.31(GND_13) U12.32(GND_14) U12.33(GND_15) U12.36(GND_16) U12.37(GND_17) U12.43(GND_18) U12.45(GND_19) U12.50(GND_20) U12.51(GND_21) U12.52(GND_22) U12.58(GND_23) U12.60(GND_24) U12.62(GND_25) U12.64(GND_26) U12.65(GND_27) U12.66(GND_28) U12.67(GND_29) U12.68(GND_30) U12.69(GND_31) U12.70(GND_32) U12.71(GND_33) U12.72(GND_34) U12.73(GND_35) U12.74(GND_36) U12.75(GND_37) U12.76(GND_38) U12.77(GND_39) U12.78(GND_40) U12.79(GND_41) U12.80(GND_42) U12.81(GND_43) U12.82(GND_44) U12.83(GND_45) U12.84(GND_46) U12.85(GND_47) U12.86(GND_48) U12.87(GND_49) U12.88(GND_50) U12.89(GND_51) U12.90(GND_52) U12.91(GND_53) U12.92(GND_54) U12.93(GND_55) U12.94(GND_56) U13.B2(GND)
VDD_3V3: C167.2 C168.2 C172.2 R82.1 U12.34(VBAT_1) U12.35(VBAT_2) U13.A1(VIN)
WIFI_1V8: C165.2 C166.2 C169.2 C170.2 C171.2 TP61.1 U12.14(VDD18) U12.63(VIO) U13.A2(VOUT)
CONFIG_AUTO: U12.23(CONFIG_AUTO_REF_DET) ; port CONFIG_AUTO
CONFIG_HOST_0: U12.12(CONFIG_HOST[0]) ; port CONFIG_HOST_0
CONFIG_HOST_1: U12.13(CONFIG_HOST[1]) ; port CONFIG_HOST_1
PMIC_32K_OUT: U12.42(PMIC_EN) ; port PMIC_32K_OUT
RF_5GHZ_WF: C162.1 C163.2 U12.20(RF)
SLP_CLK_IN: U12.61(SLP_CLK_IN) ; port SLP_CLK_IN
WAKEUP_BT: U12.41(GPIO12_/_(HOST_WAKEUP_BT)) ; port WAKEUP_BT
WAKEUP_BT_HOST: U12.30(GPIO20_/_(BT_WAKEUP_HOST)) ; port WAKEUP_BT_HOST
WAKEUP_WLAN: U12.40(GPIO13_/_(HOST_WAKEUP_WLAN)) ; port WAKEUP_WLAN
WAKEUP_WLAN_HOST: U12.27(GPIO1_/_(WLAN_WAKEUP_HOST)) ; port WAKEUP_WLAN_HOST
NetANT1_1: ANT1.1(FEED) J4.1 R81.2 TP60.1
NetC162_2: C162.2 C164.2 FL1.1(IN)
NetC173_2: C173.2 R82.2 R83.2 TP62.1 U13.B1(EN)
NetFL1_2: FL1.2(OUT) R81.1
NetU12_7: U12.7(GPIO7_/_(BT_PCM_SYNC)) ; port BT_PCM.BT_PCM_SYNC
NetU12_9: U12.9(GPIO6_/_(BT_PCM_CLK)) ; port BT_PCM.BT_PCM_CLK
NetU12_10: U12.10(GPIO5_/_(BT_PCM_DOUT)) ; port BT_PCM.BT_PCM_OUT
NetU12_11: U12.11(GPIO4_/_(BT_PCM_DIN)) ; port BT_PCM.BT_PCM_IN
NetU12_46: U12.46(GPIO11_/_(BT_UART_RTS)) ; port BT_UART.BT_UART_RXD
NetU12_47: U12.47(GPIO10_/_(BT_UART_CTS)) ; port BT_UART.BT_UART_CTS_N
NetU12_48: U12.48(GPIO9_/_(BT_UART_RXD)) ; port BT_UART.BT_UART_RTS_N
NetU12_49: U12.49(GPIO8_/_(BT_UART_TXD)) ; port BT_UART.BT_UART_TXD
NetU12_53: U12.53(SD_DAT2) ; port WIFI_SDIO.SDIO_DATA_2
NetU12_54: U12.54(SD_DAT3) ; port WIFI_SDIO.SDIO_DATA_3
NetU12_55: U12.55(SD_DAT1) ; port WIFI_SDIO.SDIO_DATA_1
NetU12_56: U12.56(SD_DAT0) ; port WIFI_SDIO.SDIO_DATA_0
NetU12_57: U12.57(SD_CMD) ; port WIFI_SDIO.SDIO_CMD
NetU12_59: U12.59(SD_CLK) ; port WIFI_SDIO.SDIO_CLK

Not connected (* = marked no-connect by the designer): U12 3(GPIO19_/_NC)* 4(GPIO18_/_NC)* 5(GPIO17)* 6(GPIO16)* 8(GPIO0)* 28(GPIO2)* 29(GPIO3)* 38(GPIO15)* 39(GPIO14)* 44(NC(PDN))*

### Layout directives
net class Z50: (no net found under the mark)

### Notes on the sheet
- Wi-FI / BL 2.4/5 GHz (802.11ac) BL 5.0
- Module System
- Matching Network WIFI 2.5GHZ/5GHz
- (near FL1) RF Filter 5GHz
- Module Power
- There is an on-board, reference certified pcb, trace antenna. This can be used for testing/evaluation purposes, but also for the final product. Also, for testing and evaluation purposes, it is possible to disconnect the on-board antenna and instead use an u.fl. connector to connect an external antenna.
- 1V8 For WiFi
- PCB Des :
- Approv By :
- Project Title :
- Sheet Title :
- Date :
- Page :
- PCB Version :
- PCB Revision :
- Size :
- A2
- (in symbol IC_WIFI_BLE_LBEE5QD1ZM-572, part A) UART; SDIO; PCM

### Library data of the parts
ANT1 = ANT_CHIP_2.5GHz_5GHz_A9001978: Automotive Ultra-small Uwb Or Bl; Manufacturer: Kyocera AVX; Supplier 1: Digikey; Manufacturer Part Number: A9001978; RoHS: No; Category: Uncategorized; Stock 1: 3990; Pricing 1: 1=1.53, 10=1.367, 25=1.2976, 100=1.066, 250=0.99652, 500=0.88064, 1000=0.69525, 2500=0.6489 (USD); Supplier Part Number 1: 478-A9001978CT-ND
C162-C164 = CAP_10PF_50V_NP0_0402: Multilayer Ceramic Capacitor, 10 pF, 50 V, ± 1%, C0G (NP0), 0402 [1005 Metric]; Manufacturer: Murata; Material: 4241ConductorMaterial; Temperature Coefficient: 30ppm/°C; Supplier 1: Digikey; Manufacturer Part Number: GJM1555C1H100FB01D; RoHS: Yes; Category: Ceramic Capacitors; Stock 1: 104534; Pricing 1: 1=0.17, 10=0.113, 50=0.0676, 100=0.0532, 500=0.03926, 1000=0.03251, 2500=0.03026, 5000=0.02768 (USD); Mount: Surface Mount; Case Code (Imperial): 0402; Case Code (Metric): 1005; Weight: 2.3E-05oz; Min Operating Temperature: -55°C; Max Operating Temperature: 125°C; Packaging: Tape and Reel; Tolerance: 1%; Voltage Rating (DC): 50V; Dielectric: C0G; Termination: SMD/SMT; Voltage: 50V; Series: GJM; Construction: Flat; Length: 1mm; Width: 0.02inch; Height: 0.5mm; Thickness: 0.022inch; Depth: 0.5mm; Radiation Hardening: No; Reach SVHC Compliant: No; Lead Free: Lead Free; RoHS Compliant: Yes; ComponentLink1URL: https://datasheet.ciiva.com/11607/c02e-11607390.pdf?src-supplier=Avnet; ComponentLink1Description: https://datasheet.ciiva.com/11607/c02e-11607390.pdf?src-supplier=Avnet; Supplier Part Number 1: 490-11189-1-ND
C165 C167 C170 = CAP_100NF_16V_X7R_0402: Multilayer Ceramic Capacitor, 0.1 uF, 16 V, ± 10%, X7R, 0402 [1005 Metric]; Manufacturer: Samsung; Supplier 1: Digi-Key; Manufacturer Part Number: CL05B104KO5NNNC; RoHS: Yes; Category: Ceramic Capacitors; Stock 1: 11081064; Pricing 1: 1=0.1, 10=0.024, 50=0.013, 100=0.0105, 500=0.00752, 1000=0.00592, 2500=0.00538, 5000=0.00495 (USD); Mount: Surface Mount; Case Code (Metric): 1005; Case Code (Imperial): 0402; Material: Ceramic; Min Operating Temperature: -55°C; Max Operating Temperature: 125°C; Tolerance: 10%; Package Quantity: 1; Packaging: Tape and Reel; Dielectric: X7R; Series: CL; Voltage: 16V; Voltage Rating (DC): 16V; Construction: Flat; Length: 1mm; Width: 0.02inch; Height: 0.5mm; Thickness: 0.022inch; Depth: 0.5mm; Radiation Hardening: No; RoHS Compliant: Yes; Lead Free: Lead Free; ComponentLink1URL: https://datasheet.ciiva.com/26920/getdatasheetpartid-359683-26920169.pdf?src-supplier=Verical; ComponentLink1Description: https://datasheet.ciiva.com/26920/getdatasheetpartid-359683-26920169.pdf?src-supplier=Verical; ComponentLink2URL: https://datasheet.ciiva.com/29198/458718-da-01-en-vs-kondensator-0402-29198423.pdf?src-supplier=Conrad; ComponentLink2Description: https://datasheet.ciiva.com/29198/458718-da-01-en-vs-kondensator-0402-29198423.pdf?src-supplier=Conrad; ComponentLink3URL: https://datasheet.ciiva.com/16208/cl05b104kq5nnnc-16208343.pdf?src-supplier=Future+Electronics; ComponentLink3Description: https://datasheet.ciiva.com/16208/cl05b104kq5nnnc-16208343.pdf?src-supplier=Future+Electronics; ComponentLink4URL: https://datasheet.ciiva.com/26309/mlcc-catalogdownload2013-eng-26309003.pdf?src-supplier=Distrelec; ComponentLink4Description: https://datasheet.ciiva.com/26309/mlcc-catalogdownload2013-eng-26309003.pdf?src-supplier=Distrelec; Supplier Part Number 1: 1276-1001-6-ND
C166 C171 C172 = CAP_1UF_10V_X6S_0402: 0402 10 V 1 uF ±10% Tolerance X6S Multilayer Ceramic Capacitor; Manufacturer: Murata; Supplier 1: Digikey; Manufacturer Part Number: GRM155C81A105KA12D; RoHS: Yes; Category: Ceramic Capacitors; Stock 1: 2486564; Pricing 1: 1=0.1, 10=0.045, 50=0.026, 100=0.0202, 500=0.01518, 1000=0.01192, 2500=0.01084, 5000=0.00997 (USD); Mount: Surface Mount; Case Code (Metric): 1005; Material: Ceramic; Case Code (Imperial): 0402; Weight: 0.000212oz; Min Operating Temperature: -55°C; Max Operating Temperature: 105°C; Dielectric: X6S; Packaging: Tape and Reel; Termination: SMD/SMT; Voltage Rating (DC): 10V; Package Quantity: 10000; Series: GRM; Length: 1mm; Width: 0.5mm; Height: 0.5mm; Thickness: 0.022inch; Lead Free: Lead Free; RoHS Compliant: Yes; ComponentLink1URL: http://www.mouser.com/ds/2/281/c02e-2905.pdf?src-supplier=Mouser; ComponentLink1Description: http://www.mouser.com/ds/2/281/c02e-2905.pdf?src-supplier=Mouser; ComponentLink2URL: https://datasheet.octopart.com/GRM155C81A105KA12D-Murata-datasheet-22122223.pdf?src-supplier=Future+Electronics; ComponentLink2Description: https://datasheet.octopart.com/GRM155C81A105KA12D-Murata-datasheet-22122223.pdf?src-supplier=Future+Electronics; ComponentLink3URL: https://datasheet.octopart.com/GRM155C81A105KA12D-Murata-datasheet-149522926.pdf?src-supplier=Newark; ComponentLink3Description: https://datasheet.octopart.com/GRM155C81A105KA12D-Murata-datasheet-149522926.pdf?src-supplier=Newark; ComponentLink4URL: http://search.murata.co.jp/Ceramy/image/img/A01X/G101/ENG/GRM155C81A105KA12-01.pdf?src-supplier=Digikey; ComponentLink4Description: http://search.murata.co.jp/Ceramy/image/img/A01X/G101/ENG/GRM155C81A105KA12-01.pdf?src-supplier=Digikey; ComponentLink5URL: http://search.murata.co.jp/Ceramy/image/img/A01X/partnumbering_e_01.pdf?src-supplier=Digikey; ComponentLink5Description: http://search.murata.co.jp/Ceramy/image/img/A01X/partnumbering_e_01.pdf?src-supplier=Digikey; ComponentLink6URL: https://datasheet.octopart.com/GRM155C81A105KA12D-Murata-datasheet-165579666.pdf?src-supplier=TME; ComponentLink6Description: https://datasheet.octopart.com/GRM155C81A105KA12D-Murata-datasheet-165579666.pdf?src-supplier=TME; Supplier Part Number 1: 490-12699-6-ND; Tolerance: 10%
C168 C169 = CAP_4.7UF_10V_X5R_0402: Multilayer Ceramic Capacitor, 4.7 uF, 10 V, ± 10%, X5R, 0402 [1005 Metric]; Manufacturer: Samsung; Supplier 1: Digikey; Manufacturer Part Number: CL05A475KP5NRNC; RoHS: Yes; Category: Ceramic Capacitors; Stock 1: 748042; Pricing 1: 1=0.28, 10=0.184, 50=0.129, 100=0.1042, 500=0.0774, 1000=0.06772, 2500=0.0645, 5000=0.05966 (USD); Mount: Surface Mount; Case Code (Metric): 1005; Case Code (Imperial): 0402; Material: Ceramic; Min Operating Temperature: -55°C; Max Operating Temperature: 85°C; Tolerance: 10%; Packaging: Tape and Reel; Package Quantity: 1; Dielectric: X5R; Series: CL; Construction: Flat; Length: 1mm; Width: 0.02inch; Height: 0.5mm; Thickness: 0.022inch; Depth: 0.5mm; Radiation Hardening: No; RoHS Compliant: Yes; Lead Free: Lead Free; ComponentLink1URL: https://datasheet.ciiva.com/25724/cl05a475kp5nrnc-25724404.pdf?src-supplier=Digikey; ComponentLink1Description: https://datasheet.ciiva.com/25724/cl05a475kp5nrnc-25724404.pdf?src-supplier=Digikey; ComponentLink2URL: https://datasheet.ciiva.com/29198/458873-da-01-en-vs-kondensator-0402-29198304.pdf?src-supplier=Conrad; ComponentLink2Description: https://datasheet.ciiva.com/29198/458873-da-01-en-vs-kondensator-0402-29198304.pdf?src-supplier=Conrad; Supplier Part Number 1: 1276-1480-1-ND
C173 = CAP_0.22UF_10V_X5R_0201: Multilayer Ceramic Capacitors (High dielectric type), 10V, 0.22 uF, ± 20 %, 0201, X5R, RoHS; Manufacturer: Taiyo Yuden; Material: 4241ConductorMaterial; Tolerance: 20%; Supplier 1: Digikey; Manufacturer Part Number: LMK063BJ224MP-F; RoHS: Yes; Category: Ceramic Capacitors; Stock 1: 6053224; Pricing 1: 1=0.12, 10=0.08, 50=0.0478, 100=0.0375, 500=0.02772, 1000=0.02295, 2500=0.02136, 5000=0.01954 (USD); Mount: Surface Mount; Case Code (Metric): 0603; Case Code (Imperial): 0201; Min Operating Temperature: -55°C; Max Operating Temperature: 85°C; Voltage Rating: 10V; Packaging: Tape and Reel; Package Quantity: 15000; Dielectric: X5R; Termination: SMD/SMT; Voltage: 10V; Series: M; Construction: Flat; Length: 0.6mm; Width: 0.3mm; Height: 0.3mm; Depth: 0.3mm; Radiation Hardening: No; Halogen Free: Halogen Free; RoHS Compliant: Yes; Reach SVHC Compliant: Unknown; ComponentLink1URL: https://datasheet.ciiva.com/134/lmk063bj224mp-f-ss-134995.pdf?src-supplier=Digikey; ComponentLink1Description: https://datasheet.ciiva.com/134/lmk063bj224mp-f-ss-134995.pdf?src-supplier=Digikey; ComponentLink2URL: https://datasheet.ciiva.com/11464/lmk063bj224mp-f-ss-11464053.pdf?src-supplier=Avnet; ComponentLink2Description: https://datasheet.ciiva.com/11464/lmk063bj224mp-f-ss-11464053.pdf?src-supplier=Avnet; ComponentLink3URL: https://datasheet.ciiva.com/15921/1589lmk063bj224mp-f-15921250.pdf?src-supplier=Onlinecomponents.com; ComponentLink3Description: https://datasheet.ciiva.com/15921/1589lmk063bj224mp-f-15921250.pdf?src-supplier=Onlinecomponents.com; ComponentLink4URL: https://datasheet.ciiva.com/26872/getdatasheetpartid-639019-26872592.pdf?src-supplier=Verical; ComponentLink4Description: https://datasheet.ciiva.com/26872/getdatasheetpartid-639019-26872592.pdf?src-supplier=Verical; ComponentLink5URL: https://datasheet.ciiva.com/30243/100lmk063bj224mp-f-30243150.pdf?src-supplier=Onlinecomponents.com; ComponentLink5Description: https://datasheet.ciiva.com/30243/100lmk063bj224mp-f-30243150.pdf?src-supplier=Onlinecomponents.com; ComponentLink6URL: https://datasheet.ciiva.com/28645/746258-28645141.pdf?src-supplier=Element14; ComponentLink6Description: https://datasheet.ciiva.com/28645/746258-28645141.pdf?src-supplier=Element14; ComponentLink7URL: https://datasheet.ciiva.com/5422/mlcc-all-e-541559-5422365.pdf?src-supplier=Mouser; ComponentLink7Description: https://datasheet.ciiva.com/5422/mlcc-all-e-541559-5422365.pdf?src-supplier=Mouser; Supplier Part Number 1: 587-2483-1-ND
FL1 = RF_FILTER_HIGH_PASS_DEA075150HT-8036A1: RF Filter High Pass 5150MHz 2400MHz to 2500MHz 0.5dB 50Ohm SMD 4Pin 0202 T/R; Manufacturer: TDK; Frequency: 5GHz; Supplier 1: Digikey; Manufacturer Part Number: DEA075150HT-8036A1; RoHS: No; Stock 1: 5961; Pricing 1: 1=0.24, 10=0.23, 25=0.2228, 50=0.2154, 100=0.2042, 250=0.1708, 500=0.13256, 1000=0.12625, 5000=0.11139 (USD); Mount: Surface Mount; Case Code (Imperial): 0202; Case Code (Metric): 0505; Packaging: Cut Tape; Insertion Loss: 0.5dB; Series: DEA; ComponentLink1URL: https://media.digikey.com/pdf/Data%20Sheets/TDK%20PDFs/DEA075150HT-8036A1_Rev1.0.pdf?src-supplier=Digikey; ComponentLink1Description: https://media.digikey.com/pdf/Data%20Sheets/TDK%20PDFs/DEA075150HT-8036A1_Rev1.0.pdf?src-supplier=Digikey; Supplier Part Number 1: 445-175384-1-ND
J4 = CONN_UFL_RF_5OR_U.FL-R-SMT-1(10): RF Connector, 1 Contact(s), Male, Board Mount, Surface Mount Terminal, Receptacle; Manufacturer: Hirose; Body Material: Bronze; Body Plating: Silver; Dielectric Material: Polymer; Center Contact Plating: Gold; Impedance: 50R; Connector Type: Receptacle,Male Pin; Max Frequency: 6GHz; Number of Ports: 1; Mating Cycles: 30; Insulation Resistance: 500MR; Supplier 1: Digikey; Manufacturer Part Number: U.FL-R-SMT-1(10); RoHS: Yes; Category: RF / Coaxial Connectors; Stock 1: 174716; Pricing 1: 1=1.26, 10=1.064, 25=1.0208, 50=0.9988, 100=0.9555, 250=0.8686, 500=0.78174, 1000=0.69488 (USD); Mount: Surface Mount; Contact Material: Brass; Housing Color: Beige; Weight: 0.001764oz; Min Operating Temperature: -40°C; Max Operating Temperature: 90°C; Packaging: Tape and Reel; Package Quantity: 2500; Fastening Type: SNAP-ON; Termination: Solder; Series: U.FL; Orientation: Straight; RoHS Compliant: Yes; Lead Free: 5697LeadFree; ComponentLink1URL: https://datasheet.ciiva.com/11762/0900766b8105243f-11762474.pdf?src-supplier=Rs; ComponentLink1Description: https://datasheet.ciiva.com/11762/0900766b8105243f-11762474.pdf?src-supplier=Rs; ComponentLink2URL: https://datasheet.ciiva.com/7651/91524-7651914.pdf?src-supplier=Element14; ComponentLink2Description: https://datasheet.ciiva.com/7651/91524-7651914.pdf?src-supplier=Element14; ComponentLink3URL: https://datasheet.ciiva.com/7651/91524-7651915.pdf?src-supplier=Element14; ComponentLink3Description: https://datasheet.ciiva.com/7651/91524-7651915.pdf?src-supplier=Element14; Supplier Part Number 1: H11891DKR-ND
R81 = RES_0R_5%_100mW_0402: as R72-R80 on sheet CAMERA; Supplier 1: Mouser; Manufacturer Part Number: ERJ-2GE0R00X; RoHS: Yes; Category: Chip SMD Resistors; Stock 1: 10989354; Pricing 1: 1=0.1, 10=0.013, 50=0.013, 100=0.006, 1000=0.004, 2500=0.003, 10000=0.003 (USD); Mount: Surface Mount; Case/Package: 0402; Contact Plating: Tin; Case Code (Metric): 1005; Size Code: 0402; Min Operating Temperature: -55°C; Max Operating Temperature: 155°C; Resistor Type: Thick Film; Packaging: Cut Tape; Package Quantity: 10000; Number of Terminations: 2; Termination: SMD/SMT; Max Power Dissipation: 100mW; Voltage Rating (DC): 50V; Features: Automotive AEC-Q200; Series: ERJ; Construction: Rectangular; Technology: THICK FILM; Length: 1mm; Width: 0.5mm; Height: 0.35mm; Depth: 0.5mm; Ratings: AEC-Q200; Radiation Hardening: No; Reach SVHC Compliant: No; Military Standard: Not; Lead Free: Lead Free; RoHS Compliant: Yes; ComponentLink1URL: https://datasheet.ciiva.com/11821/0900766b80f806dd-11821176.pdf?src-supplier=Rs; ComponentLink1Description: https://datasheet.ciiva.com/11821/0900766b80f806dd-11821176.pdf?src-supplier=Rs; ComponentLink2URL: https://datasheet.ciiva.com/43460/1678796-43460347.pdf?src-supplier=Farnell; ComponentLink2Description: https://datasheet.ciiva.com/43460/1678796-43460347.pdf?src-supplier=Farnell; ComponentLink3URL: https://datasheet.ciiva.com/46389/1678796-46389518.pdf?src-supplier=Element14; ComponentLink3Description: https://datasheet.ciiva.com/46389/1678796-46389518.pdf?src-supplier=Element14; ComponentLink4URL: https://datasheet.ciiva.com/5959/1678796-5959692.pdf?src-supplier=Farnell; ComponentLink4Description: https://datasheet.ciiva.com/5959/1678796-5959692.pdf?src-supplier=Farnell; ComponentLink5URL: https://datasheet.ciiva.com/28695/1678796-28695758.pdf?src-supplier=Element14; ComponentLink5Description: https://datasheet.ciiva.com/28695/1678796-28695758.pdf?src-supplier=Element14; ComponentLink6URL: https://datasheet.ciiva.com/16783/70260739-16783734.pdf?src-supplier=Allied+Electronics; ComponentLink6Description: https://datasheet.ciiva.com/16783/70260739-16783734.pdf?src-supplier=Allied+Electronics; ComponentLink7URL: https://datasheet.ciiva.com/16778/70260739-16778335.pdf?src-supplier=Allied+Electronics; ComponentLink7Description: https://datasheet.ciiva.com/16778/70260739-16778335.pdf?src-supplier=Allied+Electronics; ComponentLink8URL: https://datasheet.ciiva.com/48531/aoa0000ce1-48531077.pdf?src-supplier=Avnet; ComponentLink8Description: https://datasheet.ciiva.com/48531/aoa0000ce1-48531077.pdf?src-supplier=Avnet; ComponentLink9URL: https://datasheet.ciiva.com/30097/4aoa0000ce1-30097116.pdf?src-supplier=Onlinecomponents.com; ComponentLink9Description: https://datasheet.ciiva.com/30097/4aoa0000ce1-30097116.pdf?src-supplier=Onlinecomponents.com; Supplier Part Number 1: 667-ERJ-2GE0R00X
R82 = RES_10K_5%_100mW_0402: Res Thick Film 0402 10K Ohm 5% 1/10W ±200ppm/°C Molded SMD Punched Carrier T/R; Manufacturer: Panasonic; Power Rating: 100mW; Voltage Rating: 50V; Supplier 1: Digi-Key; Manufacturer Part Number: ERJ-2GEJ103X; RoHS: Yes; Category: Chip SMD Resistors; Stock 1: 4696986; Pricing 1: 1=0.1, 10=0.021, 50=0.0132, 100=0.011, 500=0.00744, 1000=0.00639, 5000=0.00464 (USD); Mount: Surface Mount; Contact Plating: Tin; Case Code (Metric): 1005; Case Code (Imperial): 0402; Size Code: 0402; Min Operating Temperature: -55°C; Max Operating Temperature: 155°C; Temperature Coefficient: 200ppm/°C; Packaging: Cut Tape; Resistor Type: Thick Film; Package Quantity: 10000; Number of Terminations: 2; Termination: SMD/SMT; Max Power Dissipation: 100mW; Features: Automotive AEC-Q200; Series: ERJ; Resistance Tolerance: 5%; Technology: THICK FILM; Voltage Rating (DC): 50V; Length: 1mm; Width: 0.5mm; Height: 0.35mm; Depth: 0.5mm; Ratings: AEC-Q200; Radiation Hardening: No; Reach SVHC Compliant: No; RoHS Compliant: Yes; Lead Free: 5697LeadFree; ComponentLink1URL: https://datasheet.ciiva.com/27055/1935721-27055112.pdf?src-supplier=Jameco; ComponentLink1Description: https://datasheet.ciiva.com/27055/1935721-27055112.pdf?src-supplier=Jameco; ComponentLink2URL: https://datasheet.ciiva.com/11821/0900766b80f806dd-11821170.pdf?src-supplier=Rs; ComponentLink2Description: https://datasheet.ciiva.com/11821/0900766b80f806dd-11821170.pdf?src-supplier=Rs; ComponentLink3URL: https://datasheet.ciiva.com/43460/1678796-43460391.pdf?src-supplier=Farnell; ComponentLink3Description: https://datasheet.ciiva.com/43460/1678796-43460391.pdf?src-supplier=Farnell; ComponentLink4URL: https://datasheet.ciiva.com/22785/1678796-22785949.pdf?src-supplier=Farnell; ComponentLink4Description: https://datasheet.ciiva.com/22785/1678796-22785949.pdf?src-supplier=Farnell; ComponentLink5URL: https://datasheet.ciiva.com/46371/1678796-46371910.pdf?src-supplier=Element14; ComponentLink5Description: https://datasheet.ciiva.com/46371/1678796-46371910.pdf?src-supplier=Element14; ComponentLink6URL: https://datasheet.ciiva.com/28514/1678796-28514154.pdf?src-supplier=Element14; ComponentLink6Description: https://datasheet.ciiva.com/28514/1678796-28514154.pdf?src-supplier=Element14; ComponentLink7URL: https://datasheet.ciiva.com/24070/aoa0000ce1-37422-24070679.pdf?src-supplier=Mouser; ComponentLink7Description: https://datasheet.ciiva.com/24070/aoa0000ce1-37422-24070679.pdf?src-supplier=Mouser; ComponentLink8URL: https://datasheet.ciiva.com/16767/70260739-16767130.pdf?src-supplier=Allied+Electronics; ComponentLink8Description: https://datasheet.ciiva.com/16767/70260739-16767130.pdf?src-supplier=Allied+Electronics; ComponentLink9URL: https://datasheet.ciiva.com/16774/70260739-16774504.pdf?src-supplier=Allied+Electronics; ComponentLink9Description: https://datasheet.ciiva.com/16774/70260739-16774504.pdf?src-supplier=Allied+Electronics; ComponentLink10URL: https://datasheet.ciiva.com/9194/aoa0000ce1-9194140.pdf?src-supplier=Avnet; ComponentLink10Description: https://datasheet.ciiva.com/9194/aoa0000ce1-9194140.pdf?src-supplier=Avnet; Supplier Part Number 1: P10KJCT-ND
R83 = RES_12K_1%_100mW_0402: Res Thick Film 0402 12K Ohm 1% 0.1W(1/10W) +/-100ppm/C Molded SMD Automotive Punched T/R; Manufacturer: Panasonic; Power Rating: 100mW; Voltage Rating: 50V; Temperature Coefficient: 100ppm/°C; Supplier 1: Mouser; Manufacturer Part Number: ERJ-2RKF1202X; RoHS: Yes; Category: Chip SMD Resistors; Stock 1: 301526; Pricing 1: 1=0.1, 10=0.017, 50=0.017, 100=0.008, 1000=0.006, 10000=0.003 (USD); Mount: Surface Mount; Number of Pins: 2; Case Code (Metric): 1005; Case Code (Imperial): 0402; Contact Plating: Tin; Size Code: 0402; Min Operating Temperature: -55°C; Max Operating Temperature: 155°C; Packaging: Tape and Reel; Package Quantity: 1; Resistor Type: Thick Film; Number of Terminations: 2; Termination: SMD/SMT; Max Power Dissipation: 100mW; Features: Automotive AEC-Q200; Series: ERJ; Resistance Tolerance: 1%; Construction: Rectangular; Technology: THICK FILM; Voltage Rating (DC): 50V; Length: 1mm; Width: 0.5mm; Height: 0.35mm; Depth: 0.5mm; Reach SVHC Compliant: No; Military Standard: Not; RoHS Compliant: Yes; Lead Free: 5697LeadFree; ComponentLink1URL: https://datasheet.ciiva.com/7944/aoa0000ce2-7944604.pdf?src-supplier=Element14; ComponentLink1Description: https://datasheet.ciiva.com/7944/aoa0000ce2-7944604.pdf?src-supplier=Element14; ComponentLink2URL: https://datasheet.ciiva.com/7944/426256-7944939.pdf?src-supplier=Element14; ComponentLink2Description: https://datasheet.ciiva.com/7944/426256-7944939.pdf?src-supplier=Element14; ComponentLink3URL: https://datasheet.ciiva.com/46373/1678782-46373164.pdf?src-supplier=Element14; ComponentLink3Description: https://datasheet.ciiva.com/46373/1678782-46373164.pdf?src-supplier=Element14; ComponentLink4URL: https://datasheet.ciiva.com/22673/1678782-22673676.pdf?src-supplier=Element14; ComponentLink4Description: https://datasheet.ciiva.com/22673/1678782-22673676.pdf?src-supplier=Element14; ComponentLink5URL: https://datasheet.ciiva.com/22687/1678782-22687405.pdf?src-supplier=Element14; ComponentLink5Description: https://datasheet.ciiva.com/22687/1678782-22687405.pdf?src-supplier=Element14; ComponentLink6URL: https://datasheet.ciiva.com/46373/1678782-46373165.pdf?src-supplier=Element14; ComponentLink6Description: https://datasheet.ciiva.com/46373/1678782-46373165.pdf?src-supplier=Element14; Supplier Part Number 1: 667-ERJ-2RKF1202X
TP60 = TP_PAD_SMD_SMALL: Test Point, SMD pad, round, 1.5mm, 1.6mm, 3mm diameter
TP61 TP62 = TP_PAD_SMD_Round: as TP57-TP59 on sheet MAIN_POWER
U12 = IC_WIFI_BLE_LBEE5QD1ZM-572: 2.4 to 5.825GHz Bluetooth WiFi 802.11a/b/g/-c, Bluetooth v5.1 Transceiver Module; Manufacturer_Name: Murata Electronics; Manufacturer: Murata; Datasheet Link: https://pl.mouser.com/datasheet/2/281/1/murata_type1zm-2006876.pdf; Height: 1.345mm; Manufacturer_Part_Number: LBEE5QD1ZM-572; Mouser Part Number: 81-LBEE5QD1ZM-572; Mouser Price/Stock: https://www.mouser.co.uk/ProductDetail/Murata-Electronics/LBEE5QD1ZM-572?qs=stqOd1AaK79ZX7AUUzAj%2FQ%3D%3D; Arrow Part Number: LBEE5QD1ZM-572; Arrow Price/Stock: https://www.arrow.com/en/products/lbee5qd1zm-572/murata-manufacturing?region=nac; Supplier: Mouser; Supplier Part Number: 81-LBEE5QD1ZM-572; Manufacturer Part Number: LBEE5QD1ZM-572; RoHS: No; Stock: 926; Pricing: 1=17.82, 10=16.11, 25=14.82, 50=14.48, 100=13.43, 250=12.74, 500=11.95, 1000=11.35, 10000=11.35 (USD)
U13 = IC_REG_LDO_1.8V_250mA_LP5907UVX-1.8/NOPB: Low Dropout Regulators(LDO) Positive Fixed 200mV @ 250mA 5.5V 1.8V 250mA DSBGA-4 RoHS; Manufacturer: Texas Instruments; Number of Outputs: 1; Min Input Voltage: 2.2V; Quiescent Current: 25uA; Accuracy: 2%; Dropout Voltage: 50mV; Max Supply Current: 425uA; Power Supply Rejection Ratio (PSRR): 60dB; Supplier 1: Digikey; Manufacturer Part Number: LP5907UVX-1.8/NOPB; RoHS: Yes; Category: Voltage Regulators - Linear; Stock 1: 47909; Pricing 1: 1=0.66, 10=0.564, 25=0.5268, 100=0.4214, 250=0.39128, 500=0.33108, 1000=0.25583 (USD); Mount: Surface Mount; Case/Package: SMD/SMT; Min Operating Temperature: -40°C; Max Operating Temperature: 125°C; Package Quantity: 3000; Packaging: Tape and Reel; Max Input Voltage: 5.5V; Max Output Current: 250mA; Output Voltage: 1.8V; Polarity: Positive; Output Type: Fixed; Series: -; Output Configuration: Positive; Number of Regulators: 1; Min Output Voltage: 1.8V; Output Current: 250mA; Radiation Hardening: No; Lead Free: Lead Free; RoHS Compliant: Yes; ComponentLink1URL: https://datasheet.ciiva.com/6597/lp5907-6597398.pdf?src-supplier=Digikey; ComponentLink1Description: https://datasheet.ciiva.com/6597/lp5907-6597398.pdf?src-supplier=Digikey; ComponentLink2URL: https://datasheet.ciiva.com/14278/lp5907-14278557.pdf?src-supplier=Avnet; ComponentLink2Description: https://datasheet.ciiva.com/14278/lp5907-14278557.pdf?src-supplier=Avnet; Supplier Part Number 1: 296-35634-1-ND